# EAGLE schematic pegasus (EAGLE 6.2)
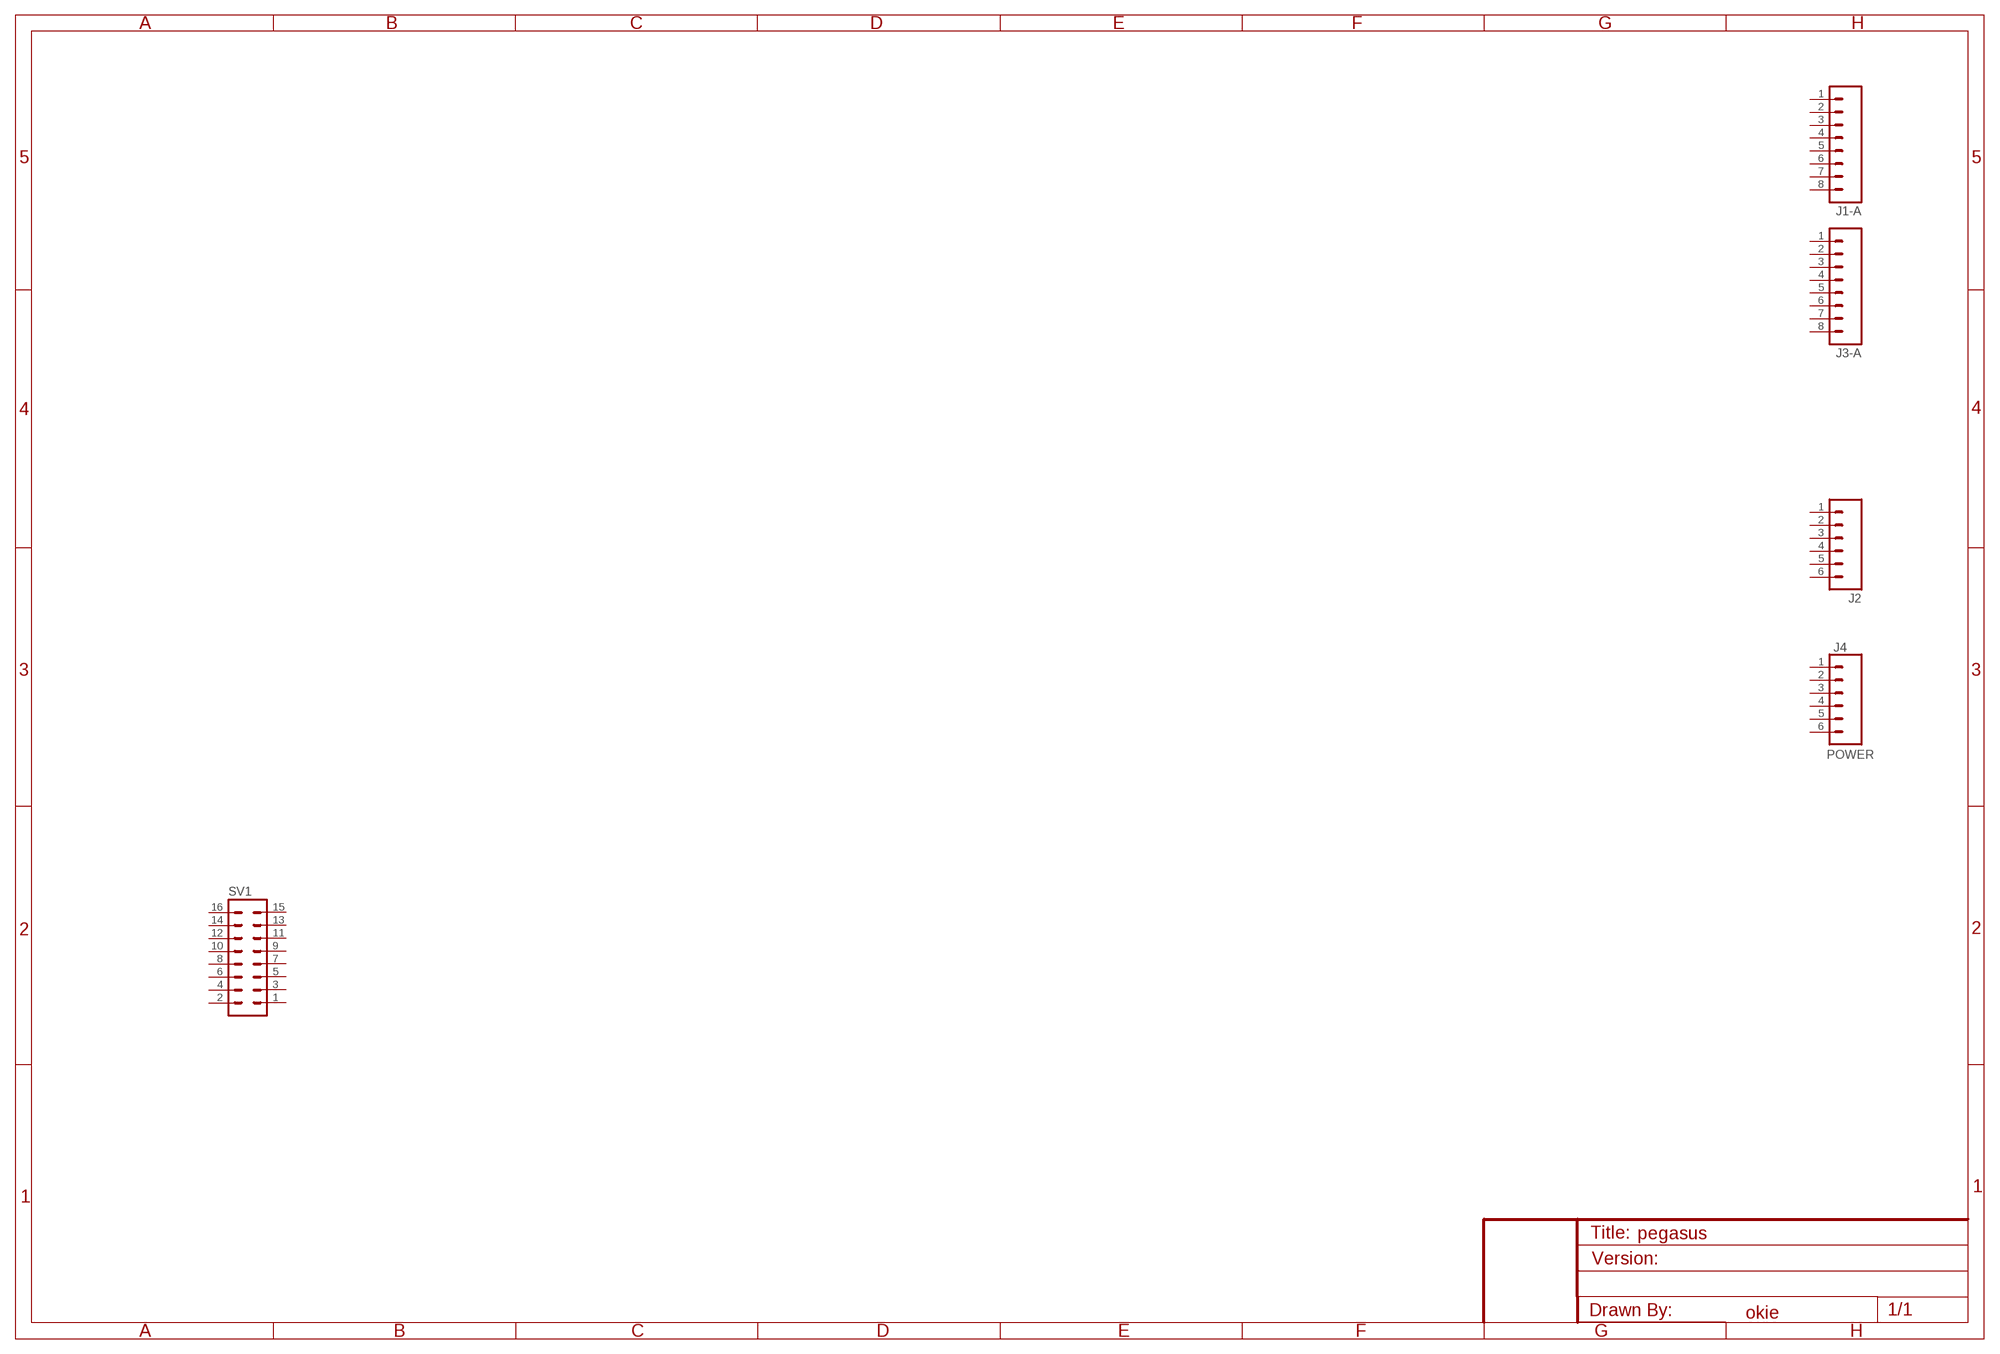
[diagram p0: schematic, sheet 1]

## Parts
J1-A  M08  [1X08]
J2  M06SIP  [1X06]
J3-A  M08  [1X08]
J4  POWER  M06SIP  [1X06]
SV1  MA08-2  [MA08-2]
Unconnected: J1-A.1 J1-A.2 J1-A.3 J1-A.4 J1-A.5 J1-A.6 J1-A.7 J1-A.8 J2.1 J2.2 J2.3 J2.4 J2.5 J2.6 J3-A.1 J3-A.2 J3-A.3 J3-A.4 J3-A.5 J3-A.6 J3-A.7 J3-A.8 J4.1 J4.2 J4.3 J4.4 J4.5 J4.6 SV1.1 SV1.2 SV1.3 SV1.4 SV1.5 SV1.6 SV1.7 SV1.8 SV1.9 SV1.10 SV1.11 SV1.12 SV1.13 SV1.14 SV1.15 SV1.16

## Notes on the sheet
- okie

## Library data of the parts
J1-A J3-A = SparkFun:M08: Header 8 Standard 8-pin 0.1" header. Use with straight break away headers (SKU : PRT-00116), right angle break away headers (PRT-00553), swiss pins (PRT-00743), machine pins (PRT-00117), and female headers (PRT-00115).
J2 J4 = SparkFun:M06: Header 6 Standard 6-pin 0.1" header. Use with straight break away headers (SKU : PRT-00116), right angle break away headers (PRT-00553), swiss pins (PRT-00743), machine pins (PRT-00117), and female headers (PRT-00115). Molex polarized connector foot print use with SKU : PRT-08094 with associated crimp pins and housings.
SV1 = con-lstb:MA08-2: PIN HEADER

## Net classes
0 default: width 0.203 mm
1 vcc: width 0.254 mm
2 gnd: width 0.305 mm, drill 0.508 mm, clearance 0.152 mm
3 usbvcc: width 0.508 mm, drill 0.508 mm, clearance 0.152 mm